# EAGLE design MTL_BaroTact2D_V2 (EAGLE 9.6.2)
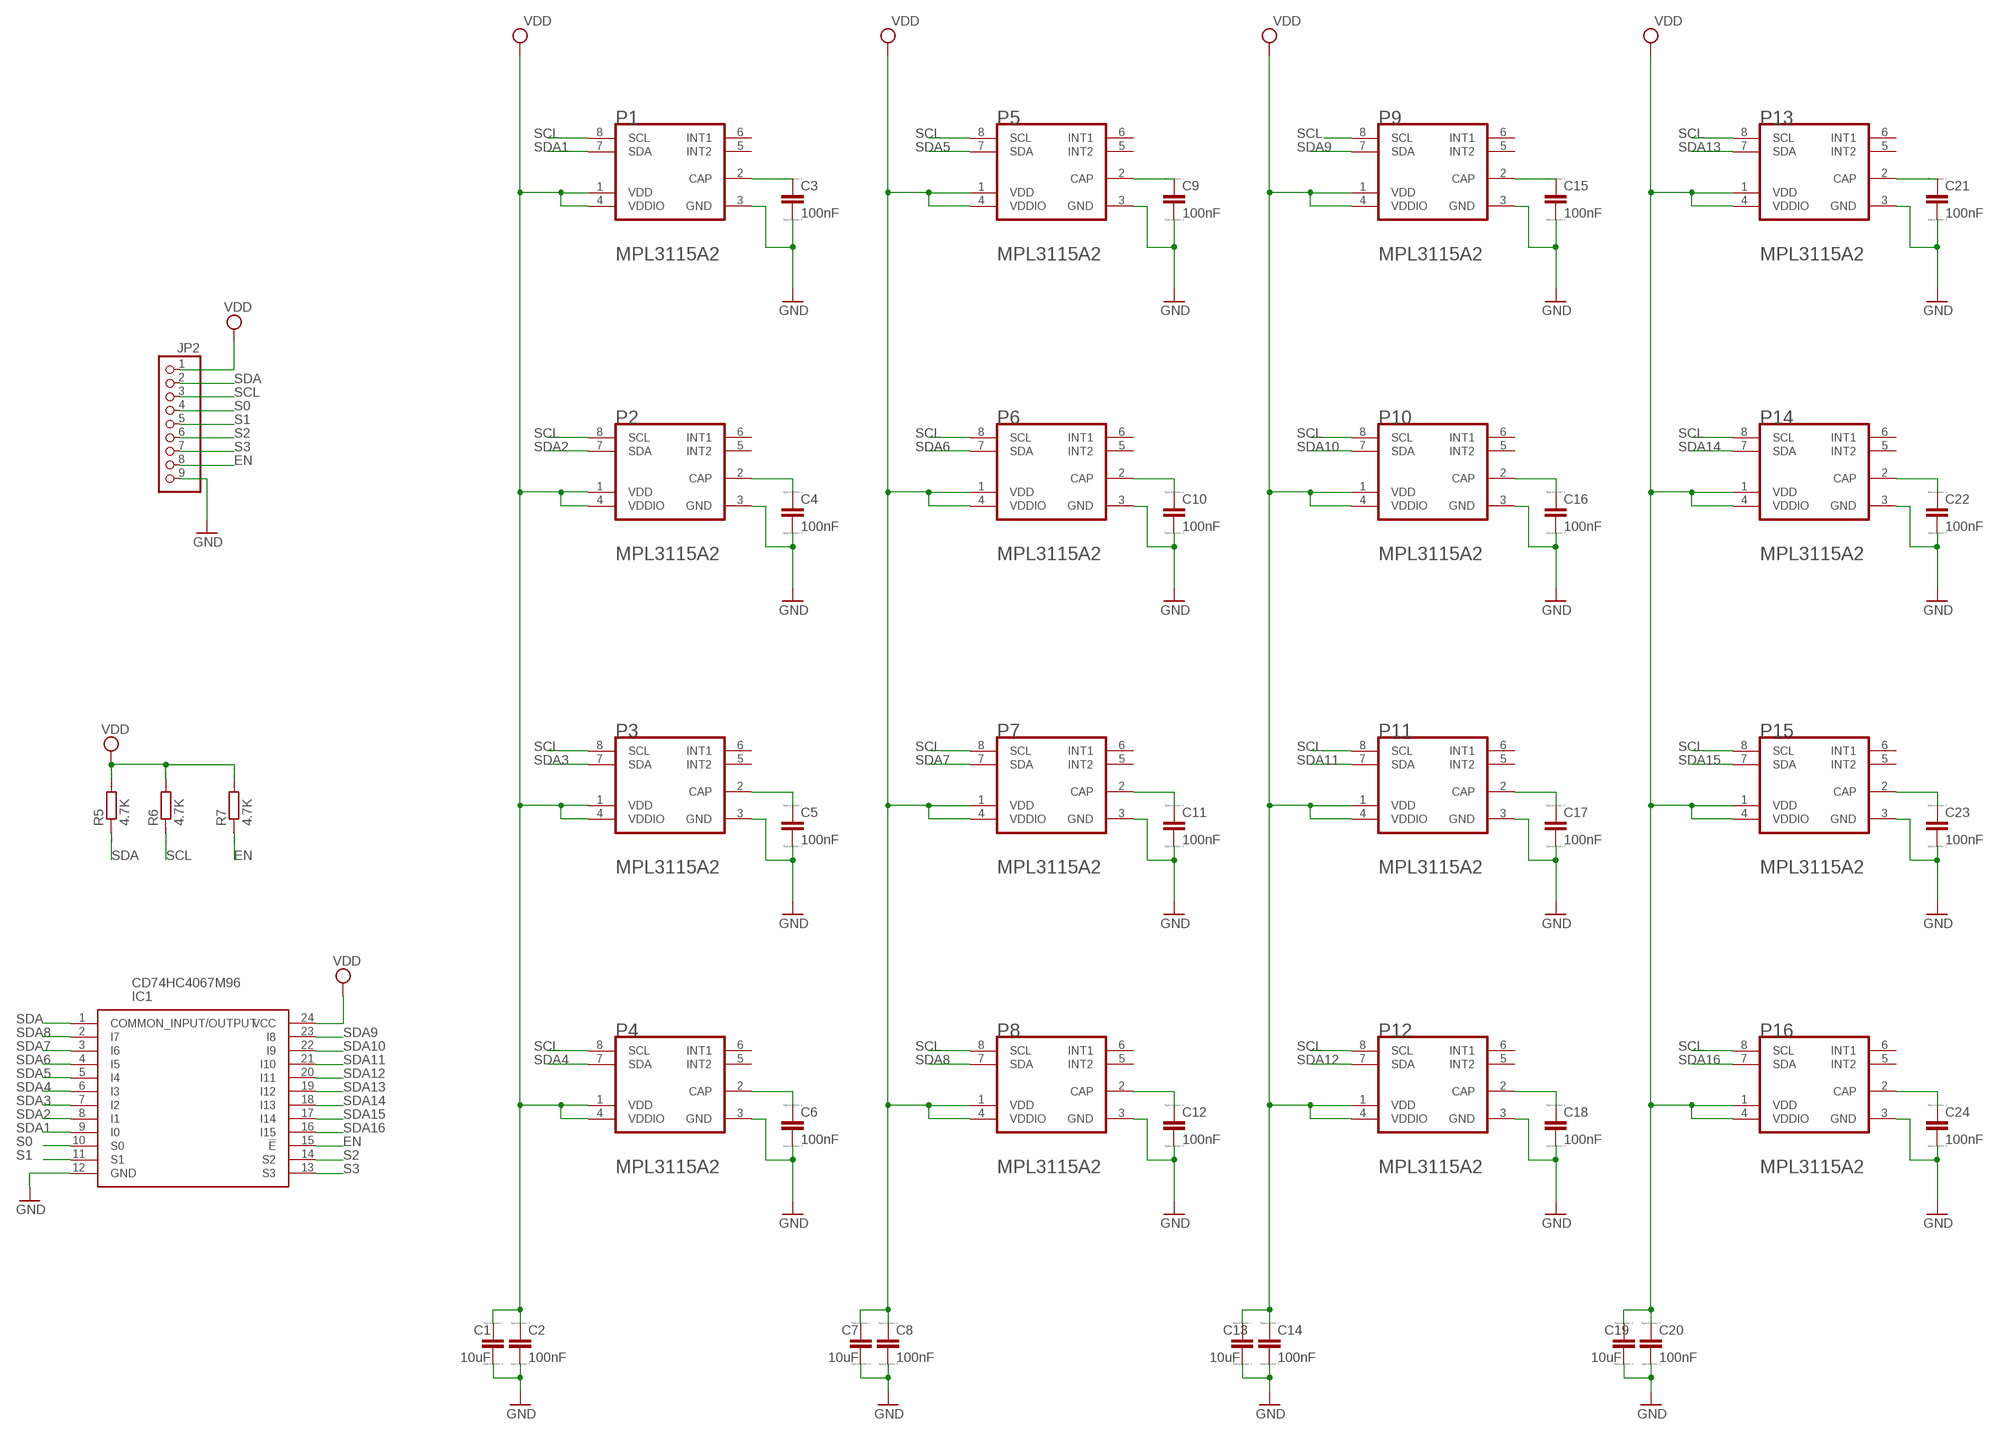
[diagram p0: schematic, sheet 1]

## Parts
C1  10uF  CC0402  [C0402]
C2  100nF  CC0402  [C0402]
C3  100nF  CC0402  [C0402]
C4  100nF  CC0402  [C0402]
C5  100nF  CC0402  [C0402]
C6  100nF  CC0402  [C0402]
C7  10uF  CC0402  [C0402]
C8  100nF  CC0402  [C0402]
C9  100nF  CC0402  [C0402]
C10  100nF  CC0402  [C0402]
C11  100nF  CC0402  [C0402]
C12  100nF  CC0402  [C0402]
C13  10uF  CC0402  [C0402]
C14  100nF  CC0402  [C0402]
C15  100nF  CC0402  [C0402]
C16  100nF  CC0402  [C0402]
C17  100nF  CC0402  [C0402]
C18  100nF  CC0402  [C0402]
C19  10uF  CC0402  [C0402]
C20  100nF  CC0402  [C0402]
C21  100nF  CC0402  [C0402]
C22  100nF  CC0402  [C0402]
C23  100nF  CC0402  [C0402]
C24  100nF  CC0402  [C0402]
IC1  CD74HC4067M96  [SOIC127P1030X265-24N]
JP2  PINHD-1X9  [1X09]
P1  FREESCALE_SEMICONDUCTOR_MPL3115A2FREESCALE_SEMICONDUCTOR_MPL3115A2_0_0  [FREESCALE_SEMICONDUCTOR_MPL3115A2_0]
P2  FREESCALE_SEMICONDUCTOR_MPL3115A2FREESCALE_SEMICONDUCTOR_MPL3115A2_0_0  [FREESCALE_SEMICONDUCTOR_MPL3115A2_0]
P3  FREESCALE_SEMICONDUCTOR_MPL3115A2FREESCALE_SEMICONDUCTOR_MPL3115A2_0_0  [FREESCALE_SEMICONDUCTOR_MPL3115A2_0]
P4  FREESCALE_SEMICONDUCTOR_MPL3115A2FREESCALE_SEMICONDUCTOR_MPL3115A2_0_0  [FREESCALE_SEMICONDUCTOR_MPL3115A2_0]
P5  FREESCALE_SEMICONDUCTOR_MPL3115A2FREESCALE_SEMICONDUCTOR_MPL3115A2_0_0  [FREESCALE_SEMICONDUCTOR_MPL3115A2_0]
P6  FREESCALE_SEMICONDUCTOR_MPL3115A2FREESCALE_SEMICONDUCTOR_MPL3115A2_0_0  [FREESCALE_SEMICONDUCTOR_MPL3115A2_0]
P7  FREESCALE_SEMICONDUCTOR_MPL3115A2FREESCALE_SEMICONDUCTOR_MPL3115A2_0_0  [FREESCALE_SEMICONDUCTOR_MPL3115A2_0]
P8  FREESCALE_SEMICONDUCTOR_MPL3115A2FREESCALE_SEMICONDUCTOR_MPL3115A2_0_0  [FREESCALE_SEMICONDUCTOR_MPL3115A2_0]
P9  FREESCALE_SEMICONDUCTOR_MPL3115A2FREESCALE_SEMICONDUCTOR_MPL3115A2_0_0  [FREESCALE_SEMICONDUCTOR_MPL3115A2_0]
P10  FREESCALE_SEMICONDUCTOR_MPL3115A2FREESCALE_SEMICONDUCTOR_MPL3115A2_0_0  [FREESCALE_SEMICONDUCTOR_MPL3115A2_0]
P11  FREESCALE_SEMICONDUCTOR_MPL3115A2FREESCALE_SEMICONDUCTOR_MPL3115A2_0_0  [FREESCALE_SEMICONDUCTOR_MPL3115A2_0]
P12  FREESCALE_SEMICONDUCTOR_MPL3115A2FREESCALE_SEMICONDUCTOR_MPL3115A2_0_0  [FREESCALE_SEMICONDUCTOR_MPL3115A2_0]
P13  FREESCALE_SEMICONDUCTOR_MPL3115A2FREESCALE_SEMICONDUCTOR_MPL3115A2_0_0  [FREESCALE_SEMICONDUCTOR_MPL3115A2_0]
P14  FREESCALE_SEMICONDUCTOR_MPL3115A2FREESCALE_SEMICONDUCTOR_MPL3115A2_0_0  [FREESCALE_SEMICONDUCTOR_MPL3115A2_0]
P15  FREESCALE_SEMICONDUCTOR_MPL3115A2FREESCALE_SEMICONDUCTOR_MPL3115A2_0_0  [FREESCALE_SEMICONDUCTOR_MPL3115A2_0]
P16  FREESCALE_SEMICONDUCTOR_MPL3115A2FREESCALE_SEMICONDUCTOR_MPL3115A2_0_0  [FREESCALE_SEMICONDUCTOR_MPL3115A2_0]
R5  4.7K  RR0603  [R0603]
R6  4.7K  RR0603  [R0603]
R7  4.7K  RR0603  [R0603]

## Nets
EN [EN]: IC1.15(!E) JP2.8 R7.1
GND: C1.2 C2.2 C3.2 C4.2 C5.2 C6.2 C7.2 C8.2 C9.2 C10.2 C11.2 C12.2 C13.2 C14.2 C15.2 C16.2 C17.2 C18.2 C19.2 C20.2 C21.2 C22.2 C23.2 C24.2 IC1.12(GND) JP2.9 P1.3(GND) P2.3(GND) P3.3(GND) P4.3(GND) P5.3(GND) P6.3(GND) P7.3(GND) P8.3(GND) P9.3(GND) P10.3(GND) P11.3(GND) P12.3(GND) P13.3(GND) P14.3(GND) P15.3(GND) P16.3(GND)
N$3: C3.1 P1.2(CAP)
N$6: C4.1 P2.2(CAP)
N$7: C9.1 P5.2(CAP)
N$9: C10.1 P6.2(CAP)
N$11: C11.1 P7.2(CAP)
N$13: C12.1 P8.2(CAP)
N$14: C5.1 P3.2(CAP)
N$15: C6.1 P4.2(CAP)
N$21: C15.1 P9.2(CAP)
N$30: C16.1 P10.2(CAP)
N$31: C17.1 P11.2(CAP)
N$32: C18.1 P12.2(CAP)
N$45: C21.1 P13.2(CAP)
N$46: C22.1 P14.2(CAP)
N$47: C23.1 P15.2(CAP)
N$48: C24.1 P16.2(CAP)
S0 [S0]: IC1.10(S0) JP2.4
S1 [S1]: IC1.11(S1) JP2.5
S2 [S2]: IC1.14(S2) JP2.6
S3 [S3]: IC1.13(S3) JP2.7
SCL [SCL]: JP2.3 P1.8(SCL) P2.8(SCL) P3.8(SCL) P4.8(SCL) P5.8(SCL) P6.8(SCL) P7.8(SCL) P8.8(SCL) P9.8(SCL) P10.8(SCL) P11.8(SCL) P12.8(SCL) P13.8(SCL) P14.8(SCL) P15.8(SCL) P16.8(SCL) R6.1
SDA [SDA]: IC1.1(COMMON_INPUT/OUTPUT) JP2.2 R5.1
SDA1: IC1.9(I0) P1.7(SDA)
SDA2: IC1.8(I1) P2.7(SDA)
SDA3: IC1.7(I2) P3.7(SDA)
SDA4: IC1.6(I3) P4.7(SDA)
SDA5: IC1.5(I4) P5.7(SDA)
SDA6: IC1.4(I5) P6.7(SDA)
SDA7: IC1.3(I6) P7.7(SDA)
SDA8: IC1.2(I7) P8.7(SDA)
SDA9: IC1.23(I8) P9.7(SDA)
SDA10: IC1.22(I9) P10.7(SDA)
SDA11: IC1.21(I10) P11.7(SDA)
SDA12: IC1.20(I11) P12.7(SDA)
SDA13: IC1.19(I12) P13.7(SDA)
SDA14: IC1.18(I13) P14.7(SDA)
SDA15: IC1.17(I14) P15.7(SDA)
SDA16: IC1.16(I15) P16.7(SDA)
VDD: C1.1 C2.1 C7.1 C8.1 C13.1 C14.1 C19.1 C20.1 IC1.24(VCC) JP2.1 P1.1(VDD) P1.4(VDDIO) P2.1(VDD) P2.4(VDDIO) P3.1(VDD) P3.4(VDDIO) P4.1(VDD) P4.4(VDDIO) P5.1(VDD) P5.4(VDDIO) P6.1(VDD) P6.4(VDDIO) P7.1(VDD) P7.4(VDDIO) P8.1(VDD) P8.4(VDDIO) P9.1(VDD) P9.4(VDDIO) P10.1(VDD) P10.4(VDDIO) P11.1(VDD) P11.4(VDDIO) P12.1(VDD) P12.4(VDDIO) P13.1(VDD) P13.4(VDDIO) P14.1(VDD) P14.4(VDDIO) P15.1(VDD) P15.4(VDDIO) P16.1(VDD) P16.4(VDDIO) R5.2 R6.2 R7.2
Unconnected: P1.5(INT2) P1.6(INT1) P2.5(INT2) P2.6(INT1) P3.5(INT2) P3.6(INT1) P4.5(INT2) P4.6(INT1) P5.5(INT2) P5.6(INT1) P6.5(INT2) P6.6(INT1) P7.5(INT2) P7.6(INT1) P8.5(INT2) P8.6(INT1) P9.5(INT2) P9.6(INT1) P10.5(INT2) P10.6(INT1) P11.5(INT2) P11.6(INT1) P12.5(INT2) P12.6(INT1) P13.5(INT2) P13.6(INT1) P14.5(INT2) P14.6(INT1) P15.5(INT2) P15.6(INT1) P16.5(INT2) P16.6(INT1)

## Library data of the parts
C1-C24 = eagle-ltspice:C: CAPACITOR, European symbol; SPICEMODEL: NONE; SPICEPREFIX: C
IC1 = CD74HC4067M96:CD74HC4067M96: High Speed CMOS 16-Channel Analog Multiplexer/Demultiplexer Source: Datasheet <http://www.ti.com/lit/gpn/cd74hc4067>; DESCRIPTION: High Speed CMOS 16-Channel Analog Multiplexer/Demultiplexer; HEIGHT: 2.65mm; MANUFACTURER_NAME: Texas Instruments; MANUFACTURER_PART_NUMBER: CD74HC4067M96; MOUSER_PART_NUMBER: 595-CD74HC4067M96; MOUSER_PRICE-STOCK: https://www.mouser.co.uk/ProductDetail/Texas-Instruments/CD74HC4067M96?qs=xFfolx0DHx0XT7d9xTTZBA%3D%3D
JP2 = pinhead:PINHD-1X9: PIN HEADER
P1-P16 = Freescale Semiconductor - MPL3115A2:FREESCALE_SEMICONDUCTOR_MPL3115A2: FRES-MPL3115A2-8; CIIVA_IDS: 1172243; COMPONENT_LINK_1_DESCRIPTION: Manufacturer URL; COMPONENT_LINK_1_URL: http://www.freescale.com/; COMPONENT_LINK_3_DESCRIPTION: Package Specification; COMPONENT_LINK_3_URL: http://cache.freescale.com/files/shared/doc/package_info/98ASA00260D.pdf; DATASHEET: http://cache.freescale.com/files/sensors/doc/data_sheet/MPL3115A2.pdf; DATASHEET_VERSION: Rev. 3.0; FOOTPRINT_VARIANT_NAME_0: Manufacturer Recommended; FSCL20_PF: 4 MHz Max.; FSCL400_PF: 400 KHz Max.; IMPORTED: yes; IMPORTED_FROM: vault; IMPORT_TS: 1521845373; MF: Freescale Semiconductor; MOUNTING_TECHNOLOGY: Surface Mount; MPN: MPL3115A2; OPERATING_TEMPERATURE_RANGE: -40 to 85 degC; PACKAGE_DESCRIPTION: 8-Pin Land Grid Array, Body 5 x 3 mm, Pitch 1.25 mm; PACKAGE_VERSION: Rev. O; PACKING: Tray; PIN_0_0_7_INSIDE_EDGE: clock; PREFIX: U; RELEASE_DATE: 1435138815; ROHS: Yes; VAULT_GUID: C9CA789F-172F-4FBE-A7EA-5C936E43DE32; VAULT_REVISION: 13F1D4E8-B129-4F1C-B772-6A98733F3276; VDD: 1.95 to 3.6 V; VDDIO: 1.62 to 3.6 V
R5-R7 = eagle-ltspice:R: RESISTOR, European symbol; SPICEMODEL: NONE; SPICEPREFIX: R

## Board
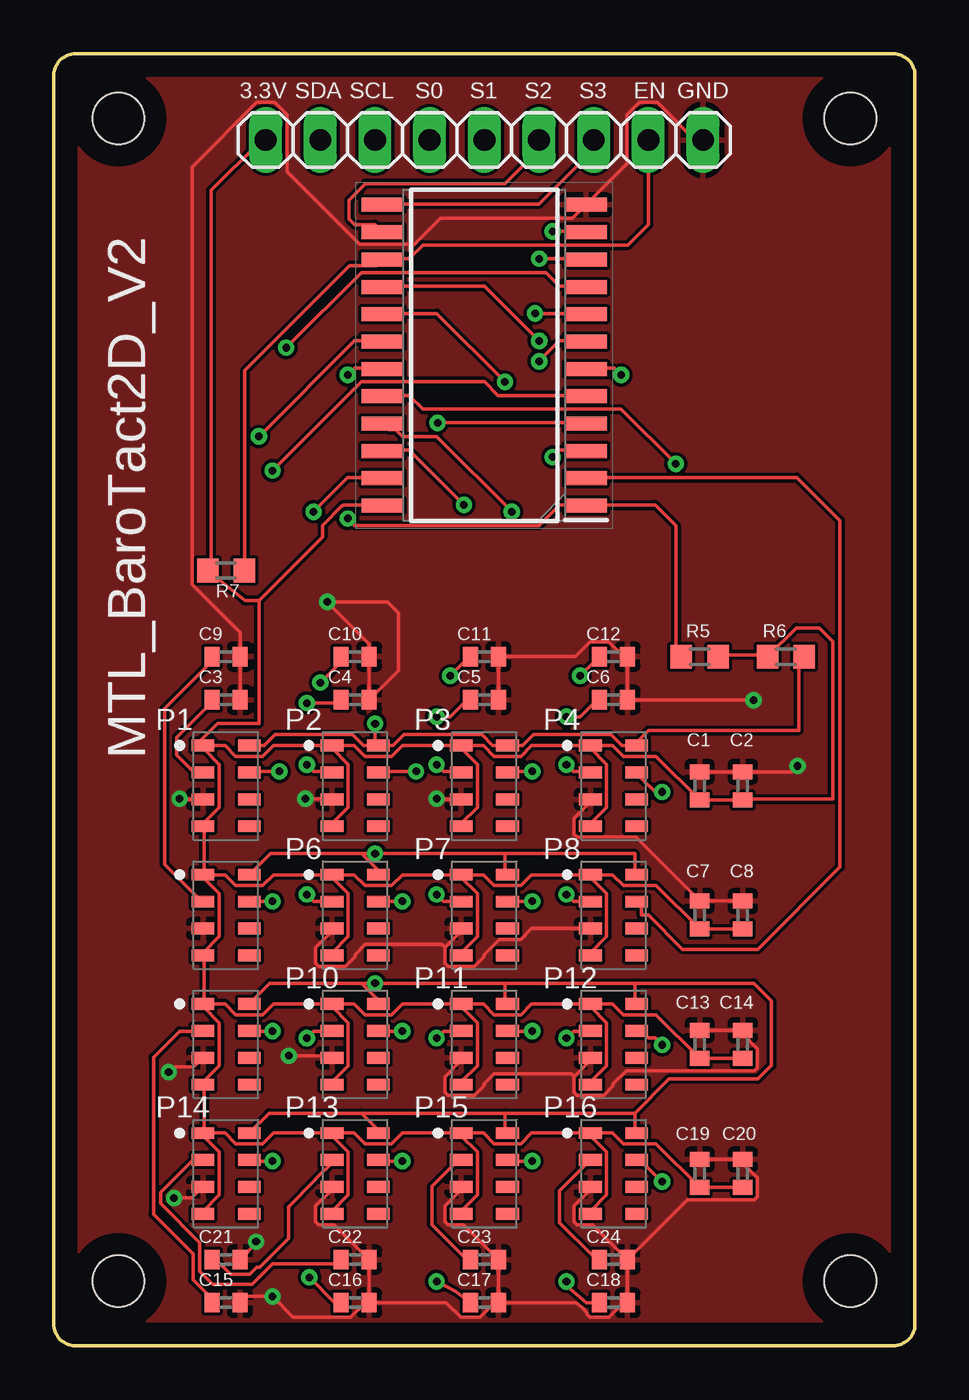
[diagram p1: board, top side]
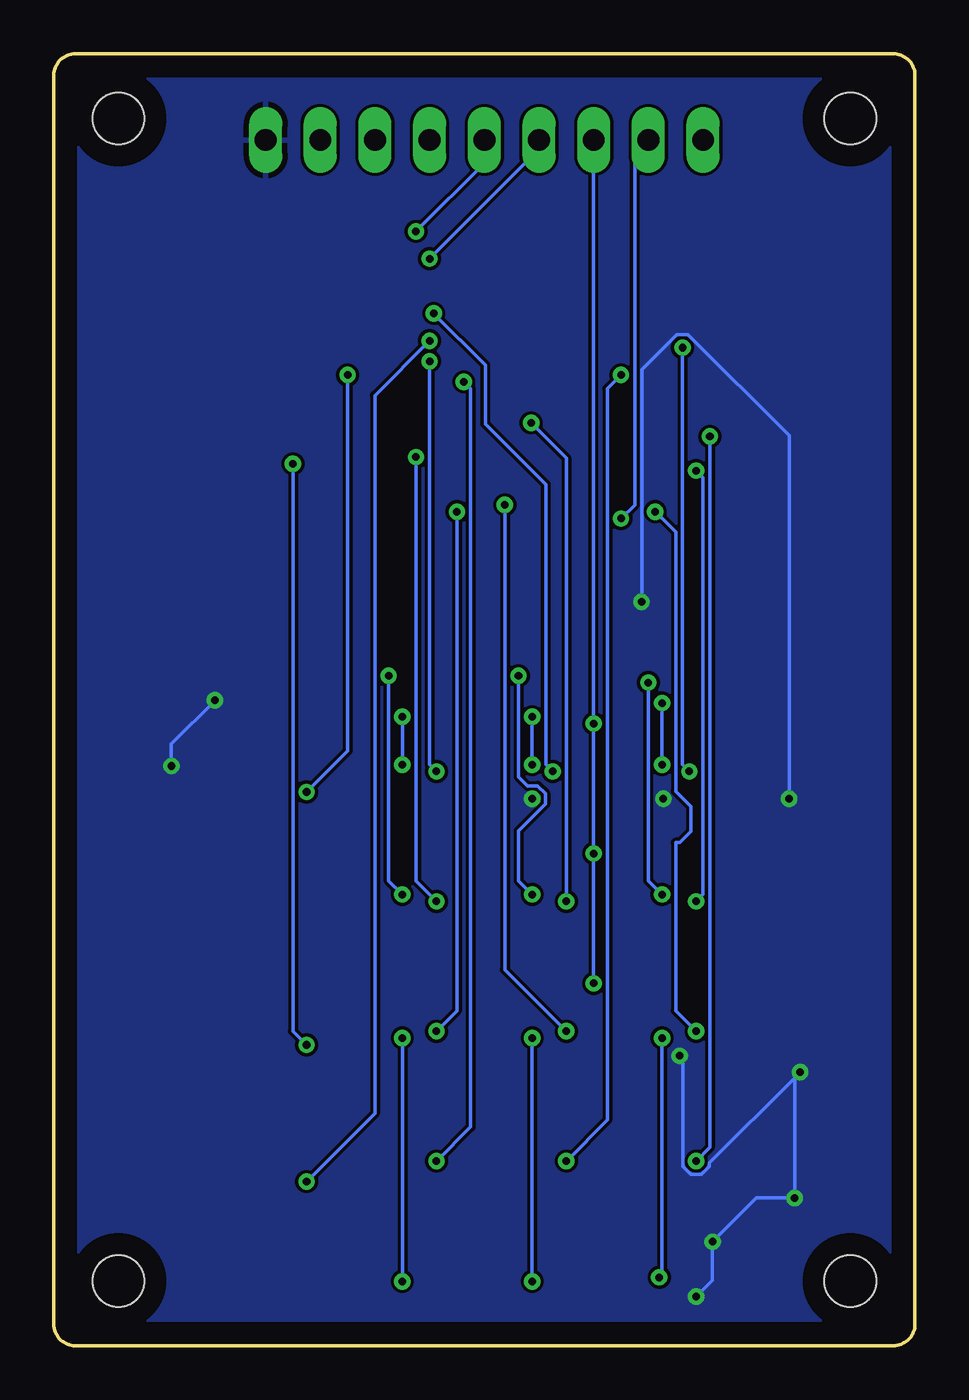
[diagram p2: board, bottom side, seen from below]

Size 40 x 60 mm. Coordinates in mm from the lower left corner, seen from the top.
Outline: 39,60 1,60 arc90 0,59 0,1 arc90 1,0 39,0 arc90 40,1 40,59 arc90 39,60
Copper layers (1*16): Top 0.035mm / dielectric 1.5mm / Bottom 0.035mm
Design rules "default": minimum track width 6mil, minimum drill 0.35mm, track to track 6mil, track to pad 6mil, pad to pad 6mil, via to via 6mil, smd to smd 6mil, copper to edge 40mil, drill to drill 6mil, minimum pad ring 10mil, minimum via ring 8mil, stop-mask expansion 4mil, vias tented up to drill 0mil, thermal gap 10mil
Holes 2.4 mm at 3,57 37,57 37,3 3,3

### Footprints (pad centres in the part's own frame; a part is rotated, then mirrored left to right if it is on the bottom)
C0402 = smd 0.7 x 0.9: 1 -0.65,0; 2 0.65,0
SOIC127P1030X265-24N = smd 1.95 x 0.65: 1 -4.725,6.985; 2 -4.725,5.715; 3 -4.725,4.445; 4 -4.725,3.175; 5 -4.725,1.905; 6 -4.725,0.635; 7 -4.725,-0.635; 8 -4.725,-1.905; 9 -4.725,-3.175; 10 -4.725,-4.445; 11 -4.725,-5.715; 12 -4.725,-6.985; 13 4.725,-6.985; 14 4.725,-5.715; 15 4.725,-4.445; 16 4.725,-3.175; 17 4.725,-1.905; 18 4.725,-0.635; 19 4.725,0.635; 20 4.725,1.905; 21 4.725,3.175; 22 4.725,4.445; 23 4.725,5.715; 24 4.725,6.985
1X09 = drill 1.016 long: 1 -10.16,0; 2 -7.62,0; 3 -5.08,0; 4 -2.54,0; 5 0,0; 6 2.54,0; 7 5.08,0; 8 7.62,0; 9 10.16,0
FREESCALE_SEMICONDUCTOR_MPL3115A2_0 = smd 1.05 x 0.55: 1 -1.075,1.875; 2 -1.075,0.625; 3 -1.075,-0.625; 4 -1.075,-1.875; 5 1.075,-1.875; 6 1.075,-0.625; 7 1.075,0.625; 8 1.075,1.875
R0603 = smd 1 x 1.1: 1 -0.85,0; 2 0.85,0

### Placement (x,y rotation side)
C1  30,26 90 top
C2  32,26 90 top
C3  8,30 0 top
C4  14,30 0 top
C5  20,30 0 top
C6  26,30 0 top
C7  30,20 90 top
C8  32,20 90 top
C9  8,32 0 top
C10  14,32 0 top
C11  20,32 0 top
C12  26,32 0 top
C13  30,14 90 top
C14  32,14 90 top
C15  8,2 0 top
C16  14,2 0 top
C17  20,2 0 top
C18  26,2 0 top
C19  30,8 90 top
C20  32,8 90 top
C21  8,4 0 top
C22  14,4 0 top
C23  20,4 0 top
C24  26,4 0 top
IC1  20,46 180 top
JP2  20,56 0 top
P1  8,26 0 top
P2  14,26 0 top
P3  20,26 0 top
P4  26,26 0 top
P5  8,20 0 top
P6  14,20 0 top
P7  20,20 0 top
P8  26,20 0 top
P9  8,14 0 top
P10  14,14 0 top
P11  20,14 0 top
P12  26,14 0 top
P13  14,8 0 top
P14  8,8 0 top
P15  20,8 0 top
P16  26,8 0 top
R5  30,32 0 top
R6  34,32 180 top
R7  8,36 180 top

### Tracks (layer width: path | path; a pad name or v marks a point on that pad's centre or on a via)
EN
  Top 0.152: 8.87,36.07 8.89,36.2 8.85,36.16 R7.1 8.87,36.02 8.87,36.07 | JP2.8 27.62,55.88 27.62,52.07 26.67,51.12 17.14,51.12 16.51,50.48 15.31,50.48 IC1.15 14.98,50.15 13.73,50.15 8.87,45.28 8.87,36.07
GND  (via drill 0.35)
  Top 0.152: C1.2 C2.2 34.27,26.65 v34.54,26.92 | C8.2 C7.2 27.03,23.62 24.3,23.62 24.17,23.75 24.17,24.5 24.93,25.25 P4.3 | C13.2 C14.2 32,14.47 32.68,13.79 32.68,12.9 32.55,12.77 26.6,12.77 25.98,12.16 25.98,12.06 25.55,11.62 24.3,11.62 24.17,11.76 24.17,12.49 | C19.2 C20.2 32,8.47 32.68,7.79 32.68,6.91 32.55,6.77 29.42,6.77 C24.2 | P1.3 5.87,25.38 v5.84,25.4 | v11.68,25.4 12.9,25.4 P2.3 | P3.3 17.8,25.38 v17.78,25.4 | C21.2 9.4,4.75 v9.4,4.83 | C15.2 8.94,2.29 v10.16,2.29 11.12,1.32 13.79,1.32 14.47,2 C16.2 | P9.3 6.5,12.95 5.59,12.95 v5.33,12.7 | v5.59,6.86 6.41,6.86 P14.3 | v10.92,13.46 12.84,13.46 P10.3 | C16.2 C22.2 13.03,5.62 12.3,5.62 12.17,5.75 12.17,6.5 12.93,7.25 P13.3 | C16.2 18.23,2 18.91,1.32 19.8,1.32 20.47,2 C17.2 | C17.2 C23.2 19.03,5.62 18.3,5.62 18.17,5.75 18.17,6.5 18.93,7.25 P15.3 | C17.2 24.26,2 24.53,1.77 24.77,1.54 24.77,1.46 24.91,1.32 25.8,1.32 26.47,2 C18.2 C24.2 | C24.2 25.03,5.62 24.3,5.62 24.17,5.75 24.17,6.5 24.93,7.25 P16.3 | 24.17,12.49 24.93,13.25 P12.3 | P11.3 18.93,13.25 18.17,12.49 18.17,11.76 18.3,11.62 19.55,11.62 19.98,12.06 19.98,12.16 20.45,12.63 24.04,12.63 24.17,12.49 | 18.17,18.5 18.17,17.75 18.3,17.62 19.55,17.62 19.98,18.06 19.98,18.16 20.7,18.87 21.7,18.87 22.2,19.38 P8.3 | 18.17,18.5 18.93,19.25 P7.3 | P6.3 12.93,19.25 12.17,18.5 12.17,17.75 12.3,17.62 13.54,17.62 13.98,18.06 13.98,18.16 14.46,18.63 18.04,18.63 18.17,18.5 | JP2.9 29.78,56 28.03,57.75 27.21,57.75 26.63,57.17 26.63,54.89 IC1.12 24.1,52.36 17.96,52.36 16.76,51.16 14.21,51.16 10.83,54.54 10.83,57.17 10.25,57.75 9.43,57.75 6.42,54.74 6.42,35.35 8.65,33.13 C9.2 C3.2
  Top 0.152: C5.2 C11.2 24.23,32 24.91,32.68 25.8,32.68 26.47,32 C12.2 C6.2 32.48,30 v32.51,29.97 | C4.2 16,31.35 16,34.04 15.49,34.54 v12.7,34.54 14.65,32.59 C10.2 C4.2
  Bottom 0.152: v10.16,2.29 9.4,3.05 v9.4,4.83 7.37,6.86 v5.59,6.86 5.59,12.45 | v5.33,12.7 5.59,12.45 | v10.92,13.46 10.77,13.31 10.77,8.32 10.41,7.97 9.91,7.97 9.55,8.32 9.55,8.48 5.59,12.45 | v12.7,34.54 12.67,34.57 12.67,45.34 11.05,46.96 10.54,46.96 5.84,42.26 v5.84,25.4 | v32.51,29.97 34.54,27.94 v34.54,26.92
  pour Top: 1,0 0,1 0,59 1,60 39,60 40,59 40,1 39,0
  pour Bottom: 1,0 0,1 0,59 1,60 39,60 40,59 40,1 39,0
N$3
  Top 0.152: C3.1 7.3,29.84 5.71,28.26 5.71,27.43 6.48,26.67 6.67,26.67 P1.2
N$6  (via drill 0.35)
  Top 0.152: v11.75,29.84 13.34,29.84 C4.1 | v11.75,26.99 12.06,26.67 12.7,26.67 P2.2
  Bottom 0.152: v11.75,26.99 v11.75,29.84
N$7
  Top 0.152: C9.1 7.3,31.75 5.14,29.59 5.14,22.35 6.87,20.62 P5.2
N$9  (via drill 0.35)
  Top 0.152: v12.38,30.8 13.34,31.75 C10.1 | v11.75,20.95 12.06,20.64 12.7,20.64 P6.2
  Bottom 0.152: v12.38,30.8 12.38,21.59 v11.75,20.95
N$11  (via drill 0.35)
  Top 0.152: v18.41,31.11 19.05,31.75 C11.1 | v17.78,20.95 18.1,20.64 18.73,20.64 P7.2
  Bottom 0.152: v18.41,31.11 18.41,26.42 18.01,26.01 17.53,26.01 17.17,25.65 17.17,25.15 18.41,23.91 18.41,21.59 v17.78,20.95
N$13  (via drill 0.35)
  Top 0.152: v24.45,31.11 25.08,31.75 C12.1 | v23.81,20.95 24.13,20.64 24.77,20.64 P8.2
  Bottom 0.152: v24.45,31.11 24.45,21.59 v23.81,20.95
N$14  (via drill 0.35)
  Top 0.152: v17.78,29.21 18.41,29.21 19.05,29.84 C5.1 | v17.78,26.99 18.1,26.67 18.73,26.67 P3.2
  Bottom 0.152: v17.78,26.99 v17.78,29.21
N$15  (via drill 0.35)
  Top 0.152: v23.81,29.21 24.45,29.21 25.08,29.84 C6.1 | v23.81,26.99 24.13,26.67 24.77,26.67 P4.2
  Bottom 0.152: v23.81,26.99 v23.81,29.21
N$21
  Top 0.152: C15.1 7.3,2.22 6.47,3.06 6.47,4.26 4.64,6.1 4.64,13.4 5.84,14.61 6.67,14.61 P9.2
N$30  (via drill 0.35)
  Top 0.152: C16.1 13.05,2 v11.87,3.17 | v11.75,14.29 12.06,14.61 12.7,14.61 P10.2
  Bottom 0.152: v11.87,3.17 11.75,3.3 v11.75,14.29
N$31  (via drill 0.35)
  Top 0.152: v17.78,2.98 18.65,2.52 C17.1 | v17.78,14.29 18.1,14.61 18.73,14.61 P11.2
  Bottom 0.152: v17.78,14.29 v17.78,2.98
N$32  (via drill 0.35)
  Top 0.152: v23.81,2.98 23.81,2.77 24.74,2 C18.1 | v23.81,14.29 24.13,14.61 24.77,14.61 P12.2
  Bottom 0.152: v23.81,14.29 v23.81,2.98
N$45
  Top 0.152: P13.2 12.93,8.5 12.17,7.75 12.17,7.73 10.9,6.46 10.9,4.98 9.56,3.65 9.42,3.65 9.1,3.32 8.21,3.32 7.53,4 C21.1
N$46
  Top 0.152: C22.1 13.34,3.81 10.16,3.81 9.21,2.86 7.37,2.86 6.77,3.46 6.77,4.79 4.95,6.6 4.95,7.11 6.4,8.56 6.62,8.56 P14.2
N$47
  Top 0.152: C23.1 19.05,4.13 17.56,5.62 17.56,7.4 18.73,8.57 P15.2
N$48
  Top 0.152: C24.1 25.08,4.13 23.5,5.71 23.5,7.2 P16.2
S0  (via drill 0.35)
  Top 0.152: v22.54,50.48 24.45,50.48 IC1.10
  Bottom 0.152: v22.54,50.48 17.46,55.56 JP2.4
S1  (via drill 0.35)
  Top 0.152: v23.18,51.75 24.45,51.75 IC1.11
  Bottom 0.152: v23.18,51.75 20,54.93 20,55.88 JP2.5
S2
  Top 0.152: JP2.6 22.23,55.88 22.23,55.24 20.95,53.98 14.48,53.98 13.72,53.21 13.72,52.32 13.97,52.07 14.92,52.07 IC1.14
S3
  Top 0.152: IC1.13 15.56,53.02 22.54,53.02 24.77,55.24 24.77,55.88 JP2.7
SCL  (via drill 0.35)
  Top 0.152: P1.8 9.77,27.88 10.27,28.38 13.88,28.38 14.38,27.88 P2.8 | P2.8 15.77,27.88 16.27,28.38 19.88,28.38 20.38,27.88 P3.8 21.77,27.88 22.27,28.38 25.88,28.38 26.38,27.88 P4.8 26.99,27.94 27.62,28.57 34.61,28.57 34.61,31.75 R6.1 | 14.29,10.79 15.24,9.84 P13.8 | 20.95,10.79 20.95,9.84 P15.8 | 14.29,10.79 20.95,10.79 | 26.99,10.79 26.99,9.84 P16.8 | 20.95,10.79 26.99,10.79 | 14.29,16.83 15.24,15.88 P10.8 | 20.95,16.83 20.95,15.88 P11.8 | 14.29,16.83 v14.92,16.83 20.95,16.83 | 26.99,16.83 26.99,15.88 P12.8 | 20.95,16.83 26.99,16.83 | 26.99,10.79 28.57,12.38 32.7,12.38 33.34,13.02 33.34,16 32.51,16.83 26.99,16.83 | 14.29,22.86 15.24,21.91 P6.8 | 20.95,22.86 20.95,21.91 P7.8 | 14.29,22.86 v14.92,22.86 20.95,22.86 | 20.95,22.86 26.99,22.86 26.99,21.91 P8.8 | v14.92,28.89 14.92,27.94 P2.8 | P5.8 10.06,22.86 14.29,22.86 | P9.8 10.03,16.83 14.29,16.83 | P14.8 9.99,10.79 14.29,10.79 | P14.8 9.18,9.88 9.21,9.84 9.11,9.84 P14.8
  Bottom 0.152: JP2.3 14.92,55.88 v14.92,28.89 v14.92,22.86 v14.92,16.83
SDA  (via drill 0.35)
  Top 0.152: R5.1 28.89,32.07 28.89,38.1 27.94,39.05 24.77,39.05 IC1.1 24.45,39.05 23.5,39.05 22.54,38.1 13.97,38.1 v13.65,38.42
  Bottom 0.152: v13.65,38.42 13.02,39.05 13.02,55.24 12.38,55.88 JP2.2
SDA1  (via drill 0.35)
  Top 0.152: v10.48,26.67 9.21,26.67 P1.7 | v10.79,46.35 14.29,49.85 22.86,49.85 23.5,49.21 24.45,49.21 IC1.9
  Bottom 0.152: v10.48,26.67 10.79,26.99 v10.79,46.35
SDA2  (via drill 0.35)
  Top 0.152: v16.83,26.67 15.24,26.67 P2.7 | v22.35,47.94 24.45,47.94 IC1.8
  Bottom 0.152: v16.83,26.67 17.14,26.99 17.14,40 19.96,42.81 19.96,45.55 v22.35,47.94
SDA3  (via drill 0.35)
  Top 0.152: v22.23,26.67 21.27,26.67 P3.7 | v22.54,45.72 23.5,46.67 24.45,46.67 IC1.7
  Bottom 0.152: v22.23,26.67 22.54,26.99 v22.54,45.72
SDA4  (via drill 0.35)
  Top 0.152: v28.26,25.72 27.94,25.72 27.3,26.35 P4.7 | v26.35,45.09 26.04,45.4 24.77,45.4 IC1.6
  Bottom 0.152: v28.26,25.72 26.35,27.62 v26.35,45.09
SDA5  (via drill 0.35)
  Top 0.152: v10.16,20.64 9.21,20.64 P5.7 | v10.16,40.64 14.29,44.77 20,44.77 20.64,44.13 24.45,44.13 IC1.5
  Bottom 0.152: v10.16,20.64 9.84,20.95 9.84,40.32 v10.16,40.64
SDA6  (via drill 0.35)
  Top 0.152: v16.19,20.64 15.24,20.64 P6.7 | v17.83,42.86 24.45,42.86 IC1.4
  Bottom 0.152: v16.19,20.64 16.19,41.23 v17.83,42.86
SDA7  (via drill 0.35)
  Top 0.152: v22.23,20.64 21.27,20.64 P7.7 | v23.18,41.27 23.5,41.59 24.45,41.59 IC1.3
  Bottom 0.152: v22.23,20.64 23.18,21.59 v23.18,41.27
SDA8
  Top 0.152: P8.7 27.3,20.64 27.3,20 27.62,20 29.21,18.41 32.7,18.41 36.51,22.23 36.51,38.32 34.51,40.32 24.77,40.32 IC1.2
SDA9  (via drill 0.35)
  Top 0.152: v10.16,14.61 9.21,14.61 P9.7 | v12.06,38.73 13.65,40.32 15.24,40.32 IC1.23
  Bottom 0.152: v10.16,14.61 11.11,15.56 11.11,23.37 10.92,23.37 10.41,23.88 10.41,25.05 11.11,25.75 11.11,37.78 v12.06,38.73
SDA10  (via drill 0.35)
  Top 0.152: v16.19,14.61 15.24,14.61 P10.7 | v19.05,39.05 16.51,41.59 15.56,41.59 IC1.22
  Bottom 0.152: v16.19,14.61 19.05,17.46 v19.05,39.05
SDA11  (via drill 0.35)
  Top 0.152: v22.23,14.61 21.27,14.61 P11.7 | v21.27,38.73 17.78,42.23 16.19,42.23 15.88,42.55 15.56,42.55 IC1.21
  Bottom 0.152: v22.23,14.61 21.27,15.56 v21.27,38.73
SDA12  (via drill 0.35)
  Top 0.152: v28.26,13.97 27.94,14.29 27.62,14.29 27.3,14.61 P12.7 | v28.89,40.96 26.35,43.5 17.14,43.5 16.51,44.13 15.56,44.13 IC1.20
  Bottom 0.152: v28.26,13.97 28.89,14.61 v28.89,40.96
SDA13  (via drill 0.35)
  Top 0.152: v16.19,8.57 15.24,8.57 P13.7 | v13.65,45.09 13.97,45.4 15.24,45.4 IC1.19
  Bottom 0.152: v16.19,8.57 14.29,10.48 14.29,44.45 v13.65,45.09
SDA14  (via drill 0.35)
  Top 0.152: v10.16,8.57 9.21,8.57 P14.7 | v9.53,42.23 13.97,46.67 15.24,46.67 IC1.18
  Bottom 0.152: v10.16,8.57 9.53,9.21 v9.53,42.23
SDA15  (via drill 0.35)
  Top 0.152: v22.23,8.57 21.27,8.57 P15.7 | v20.95,44.77 17.78,47.94 15.56,47.94 IC1.17
  Bottom 0.152: v22.23,8.57 20.64,10.16 20.64,44.45 v20.95,44.77
SDA16  (via drill 0.35)
  Top 0.152: v28.26,7.62 27.3,8.57 P16.7 | v22.54,46.67 20,49.21 15.56,49.21 IC1.16
  Bottom 0.152: v28.26,7.62 25.08,10.79 25.08,44.13 v22.54,46.67
VDD
  Top 0.152: P4.1 25.95,27.88 26.45,27.37 27.98,27.37 C1.1 C2.1 32.07,25.4 36.2,25.4 36.2,32.7 35.56,33.34 34.49,33.34 R6.2 33.02,32.07 31.11,32.07 R5.2 | P4.1 24.93,27.75 25.68,27 25.68,25 24.93,24.25 P4.4 | P4.1 22.2,27.88 21.7,27.37 20.45,27.37 19.95,27.88 P3.1 | P3.1 18.93,27.75 19.68,27 19.68,25 18.93,24.25 P3.4 | P3.1 16.2,27.88 15.7,27.37 14.46,27.37 13.95,27.88 P2.1 | P2.1 12.93,27.75 13.68,27 13.68,25 12.93,24.25 P2.4 | P2.1 10.2,27.88 9.7,27.37 8.46,27.37 7.95,27.88 P1.1 | P1.1 6.92,27.75 7.68,27 7.68,25 6.92,24.25 P1.4 6.99,24.13 6.99,21.91 P5.1 | C8.1 C7.1 27.98,21.37 26.45,21.37 25.95,21.88 P8.1 | P8.1 24.93,21.75 25.68,21 25.68,19 24.93,18.25 P8.4 | P8.1 22.2,21.88 21.7,21.37 20.45,21.37 19.95,21.88 P7.1 | P7.1 18.93,21.75 19.68,21 19.68,19 18.93,18.25 P7.4 | P7.1 16.2,21.88 15.7,21.37 14.46,21.37 13.95,21.88 P6.1 | P6.1 12.93,21.75 13.68,21 13.68,19 12.93,18.25 P6.4 | P6.1 10.2,21.88 9.7,21.37 8.46,21.37 7.95,21.88 P5.1 | P5.1 6.92,21.75 7.68,21 7.68,19 6.92,18.25 P5.4 6.99,18.1 6.99,15.88 | C14.1 C13.1 27.98,15.37 26.45,15.37 25.95,15.88 P12.1 | P12.1 24.93,15.75 25.68,14.99 25.68,13.01 24.93,12.25 P12.4 | P12.1 22.2,15.88 21.7,15.37 20.45,15.37 19.95,15.88 P11.1 | P11.1 18.93,15.75 19.68,14.99 19.68,13.01 18.93,12.25 P11.4 | P11.1 16.2,15.88 15.7,15.37 14.46,15.37 13.95,15.88 P10.1 | P10.1 12.93,15.75 13.68,14.99 13.68,13.01 12.93,12.25 P10.4 | P10.1 10.2,15.88 9.7,15.37 8.46,15.37 7.95,15.88 6.99,15.88 | C20.1 C19.1 27.98,9.37 26.45,9.37 25.95,9.88 P16.1 | P16.1 24.93,9.75 25.68,8.99 25.68,7 24.93,6.25 P16.4 | P16.1 22.2,9.88 21.7,9.37 20.45,9.37 19.95,9.88 P15.1
  Top 0.152: P15.1 18.93,9.75 19.68,8.99 19.68,7 18.93,6.25 P15.4 | P15.1 16.2,9.88 15.7,9.37 14.46,9.37 13.95,9.88 P13.1 | P13.1 12.93,9.75 13.68,8.99 13.68,7 12.93,6.25 P13.4 | P13.1 10.2,9.88 9.7,9.37 8.46,9.37 7.95,9.88 P14.1 | P14.1 6.92,9.75 7.68,8.99 7.68,7 6.92,6.25 P14.4 | 9.53,34.61 8.88,34.61 R7.2 7.3,36.2 7.3,53.66 9.53,55.88 JP2.1 | IC1.24 15.24,39.05 13.46,39.05 13.43,39.02 13.4,39.02 12.48,38.1 12.48,37.56 9.53,34.61 | P14.1 6.99,9.84 6.99,12.06 P9.4 6.92,12.25 7.68,13.01 7.68,14.99 6.92,15.75 P9.1 6.99,15.88 | 9.53,34.61 9.53,28.89 7.62,28.89 6.67,27.94 P1.1

### Text on the board
tNames: 3.3V | SDA | SCL | S0 | S1 | S2 | S3 | EN | GND | MTL_BaroTact2D_V2